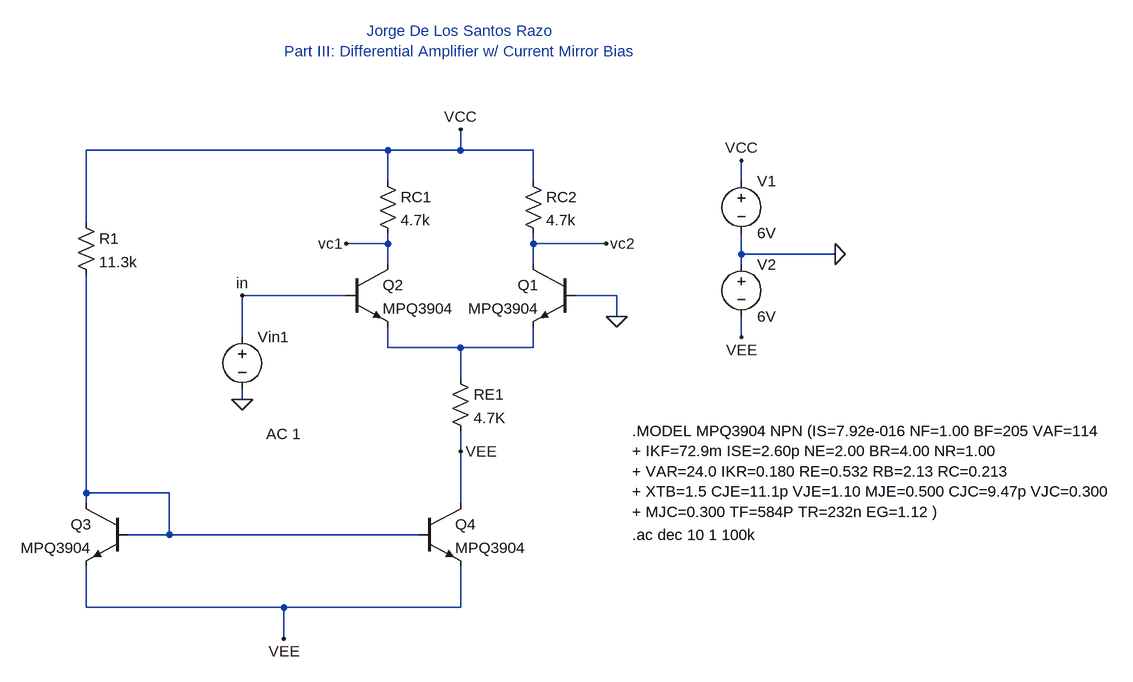
[diagram p0: schematic Diff-Amp-with-Current-Mirror-Bias.asc]
Diff-Amp-with-Current-Mirror-Bias.asc, the LTspice schematic file:
Version 4.1
SHEET 1 1884 1064
WIRE 288 -32 -176 -32
WIRE 400 -32 400 -64
WIRE 400 -32 288 -32
WIRE 512 -32 400 -32
WIRE 288 16 288 -32
WIRE 512 16 512 -32
WIRE 832 16 832 -16
WIRE -176 80 -176 -32
WIRE 288 112 288 96
WIRE 288 112 224 112
WIRE 512 112 512 96
WIRE 624 112 512 112
WIRE 832 128 832 96
WIRE 976 128 832 128
WIRE 288 144 288 112
WIRE 512 144 512 112
WIRE 832 144 832 128
WIRE 224 192 64 192
WIRE 640 192 576 192
WIRE 640 224 640 192
WIRE 64 256 64 192
WIRE 832 256 832 224
WIRE 288 272 288 240
WIRE 400 272 288 272
WIRE 512 272 512 240
WIRE 512 272 400 272
WIRE 400 320 400 272
WIRE 64 352 64 336
WIRE 400 432 400 400
WIRE -176 496 -176 160
WIRE -48 496 -176 496
WIRE -176 512 -176 496
WIRE 400 512 400 432
WIRE -48 560 -48 496
WIRE -48 560 -112 560
WIRE 336 560 -48 560
WIRE -176 672 -176 608
WIRE 128 672 -176 672
WIRE 400 672 400 608
WIRE 400 672 128 672
WIRE 128 720 128 672
FLAG 64 352 0
FLAG 400 432 VEE
FLAG 400 -64 VCC
FLAG 640 224 0
FLAG 832 256 VEE
FLAG 832 -16 VCC
FLAG 976 128 0
FLAG 224 112 vc1
FLAG 64 192 in
FLAG 624 112 vc2
FLAG 128 720 VEE
SYMBOL npn 576 144 M0
SYMATTR InstName Q1
SYMATTR Value MPQ3904
SYMBOL npn 224 144 R0
SYMATTR InstName Q2
SYMATTR Value MPQ3904
SYMBOL res 272 0 R0
SYMATTR InstName RC1
SYMATTR Value 4.7k
SYMBOL res 496 0 R0
SYMATTR InstName RC2
SYMATTR Value 4.7k
SYMBOL res 384 304 R0
SYMATTR InstName RE1
SYMATTR Value 4.7K
SYMBOL voltage 64 240 R0
WINDOW 3 37 137 Left 2
WINDOW 123 37 165 Left 2
WINDOW 39 0 0 Left 0
SYMATTR Value ""
SYMATTR Value2 AC 1
SYMATTR InstName Vin1
SYMBOL voltage 832 0 R0
SYMATTR InstName V1
SYMATTR Value 6V
SYMBOL voltage 832 128 R0
SYMATTR InstName V2
SYMATTR Value 6V
SYMBOL npn -112 512 M0
SYMATTR InstName Q3
SYMATTR Value MPQ3904
SYMBOL npn 336 512 R0
SYMATTR InstName Q4
SYMATTR Value MPQ3904
SYMBOL res -192 64 R0
SYMATTR InstName R1
SYMATTR Value 11.3k
TEXT 664 400 Left 2 !.MODEL MPQ3904 NPN (IS=7.92e-016 NF=1.00 BF=205 VAF=114\n+ IKF=72.9m ISE=2.60p NE=2.00 BR=4.00 NR=1.00\n+ VAR=24.0 IKR=0.180 RE=0.532 RB=2.13 RC=0.213\n+ XTB=1.5 CJE=11.1p VJE=1.10 MJE=0.500 CJC=9.47p VJC=0.300\n+ MJC=0.300 TF=584P TR=232n EG=1.12 )
TEXT 400 -200 Center 2 ;Jorge De Los Santos Razo\nPart III: Differential Amplifier w/ Current Mirror Bias
TEXT 664 560 Left 2 !.ac dec 10 1 100k

The netlist it stands for:
* Diff-Amp-with-Current-Mirror-Bias.asc
Q1 vc2 0 N001 0 MPQ3904
Q2 vc1 in N001 0 MPQ3904
RC1 VCC vc1 4.7k
RC2 VCC vc2 4.7k
RE1 N001 VEE 4.7K
Vin1 in 0 AC 1
V1 VCC 0 6V
V2 0 VEE 6V
Q3 N002 N002 VEE 0 MPQ3904
Q4 VEE N002 VEE 0 MPQ3904
R1 VCC N002 11.3k
.model NPN NPN
.model PNP PNP
.lib standard.bjt
.MODEL MPQ3904 NPN (IS=7.92e-016 NF=1.00 BF=205 VAF=114
+ IKF=72.9m ISE=2.60p NE=2.00 BR=4.00 NR=1.00
+ VAR=24.0 IKR=0.180 RE=0.532 RB=2.13 RC=0.213
+ XTB=1.5 CJE=11.1p VJE=1.10 MJE=0.500 CJC=9.47p VJC=0.300
+ MJC=0.300 TF=584P TR=232n EG=1.12 )
* Jorge De Los Santos Razo
* Part III: Differential Amplifier w/ Current Mirror Bias
.ac dec 10 1 100k
.backanno
.end